# Altium schematic sheet USB_CON.SchDoc
size A4; SheetNumber: 9; SheetTotal: 13
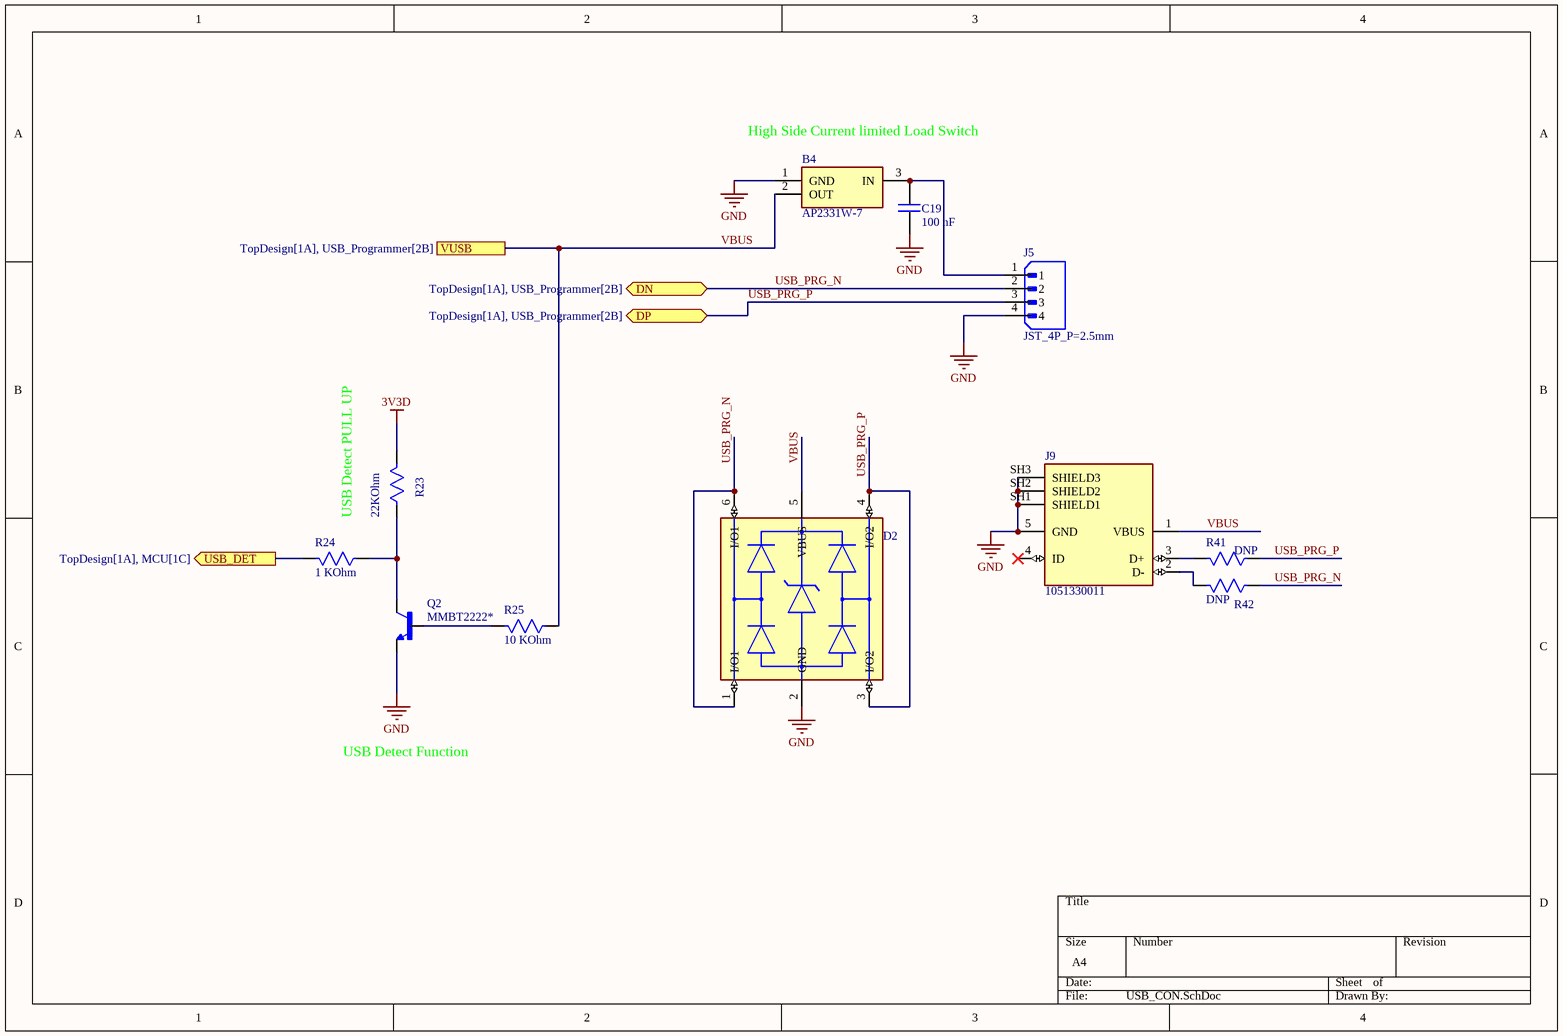
[diagram p0: USB_CON.SchDoc]

## Parts
B4  AP2331W-7  [AP2331W-7-(SOT-23-3)]
C19  100 nF  [CAP_0603]
D2  USBLC6-2SC6  [USBLC6-2SC6]  (value not drawn)
J5  JST_4P_P=2.5mm  [JST_4P_Straight_P=2.5mm]
J9  1051330011  [USB_Micro_B_90_MOLEX_1051330011]
Q2  MMBT2222*  [Bipolar _BJT_ Transistor]
R23  22KOhm  [Res_0603]
R24  1 KOhm  [Res_0603]
R25  10 KOhm  [Res_0603]
R41  DNP  [Res_0603]
R42  DNP  [Res_0603]

## Ports
DN (bidir, see TopDesign[1A], USB_Programmer[2B]), DP (bidir, see TopDesign[1A], USB_Programmer[2B]), USB_DET (out, see TopDesign[1A], MCU[1C]), VUSB (see TopDesign[1A], USB_Programmer[2B])

## Nets
3V3D: R23.1
GND: B4.1(GND) C19.2 D2.2(GND) J5.4 J9.5(GND) J9.SH1(SHIELD1) J9.SH2(SHIELD2) J9.SH3(SHIELD3) Q2.E
USB_DET: R24.1 ; port USB_DET
USB_PRG_N: D2.1(I/O1) D2.6(I/O1) J5.2 R42.2 ; port DN
USB_PRG_P: D2.3(I/O2) D2.4(I/O2) J5.3 R41.2 ; port DP
VBUS: B4.2(OUT) D2.5(VBUS) J9.1(VBUS) R25.2 ; port VUSB
NetB4_3: B4.3(IN) C19.1 J5.1
NetJ9_2: J9.2(D-) R42.1
NetJ9_3: J9.3(D+) R41.1
NetQ2_B: Q2.B R25.1
NetQ2_C: Q2.C R23.2 R24.2

Not connected (* = marked no-connect by the designer): J9 4(ID)*

## Notes on the sheet
- High Side Current limited Load Switch
- USB Detect PULL UP
- USB Detect Function

## Library data of the parts
B4 = AP2331W-7: High Side Current limited Load Switch 2.7V~5.2V 250mΩ 200mA; Manufacturer_Name: Diodes Incorporated; Geometry.Height: 1.3mm; Manufacturer_Part_Number: AP2331W-7; Datasheet Link: https://www.diodes.com//assets/Datasheets/AP2331.pdf; Package: SC-59 , SOT-23; LCSC: SC-59 : C460346 , SOT23 :  C500764
C19 = Cap SMD: Cap SMD.
D2 = USBLC6-2SC6: 5A 17V 6V Unidirectional 5.25V SOT-23-6L ESD and Surge Protection (TVS/ESD) ROHS , 2 data-line USB 2.0 protection, Protects VBUS, capacitance: 3.5 pF; MPN: ST Micro Electronics; MFPN: USBLC6-2SC6; Package: SOT-23-6L; Datasheet: https://www.st.com/resource/en/datasheet/usblc6-2.pdf; Application: USB 2.0 , Data & Power Protection; LCSC: C7519
J5 = JST_4P_P=2.5mm: Connector Header Through Hole 4 position 0.098 (2.50mm); MF: JST Sales; MP: B4B-XH-A(LF)(SN); SnapEDA_Link: https://www.snapeda.com/parts/B4B-XH-A(LF)(SN)/JST+Sales+America+Inc./view-part/?ref=snap; Package: None; Value: *; Check_prices: https://www.snapeda.com/parts/B4B-XH-A(LF)(SN)/JST+Sales+America+Inc./view-part/?ref=eda
J9 = 1051330011: USB - micro B USB 2.0 Receptacle Connector 5 Position Surface Mount; MF: Molex; SnapEDA_Link: https://www.snapeda.com/parts/1051330011/Molex/view-part/?ref=snap; Package: None; Value: *; MP: 1051330011; Check_prices: https://www.snapeda.com/parts/1051330011/Molex/view-part/?ref=eda
Q2 = MMBT2222*: Bipolar _BJT_ Transistor NPN 30V 600mA 250MHz 350mW Surface Mount SOT-23-3; MF: ON Semiconductor; Package: SOT-23-3 Fairchild Semiconductor; Value: *; Price: None; MP: MMBT2222; Availability: Unavailable; SnapEDA_Link: https://www.snapeda.com/parts/MMBT2222/ON%20Semiconductor/view-part/214298/?ref=snap
R23-R25 R41 R42 = Res smd: SMD Resistor; MP: RC0805FR-07330RL; MF: Yageo; Package: 2012 Rohm Semiconductor; Value: *; SnapEDA_Link: https://www.snapeda.com/parts/RC0805FR-07330RL/Yageo/view-part/106115/?ref=snap; Price: None; Availability: Unavailable